# EAGLE design Datalogger (EAGLE 7.1.0)
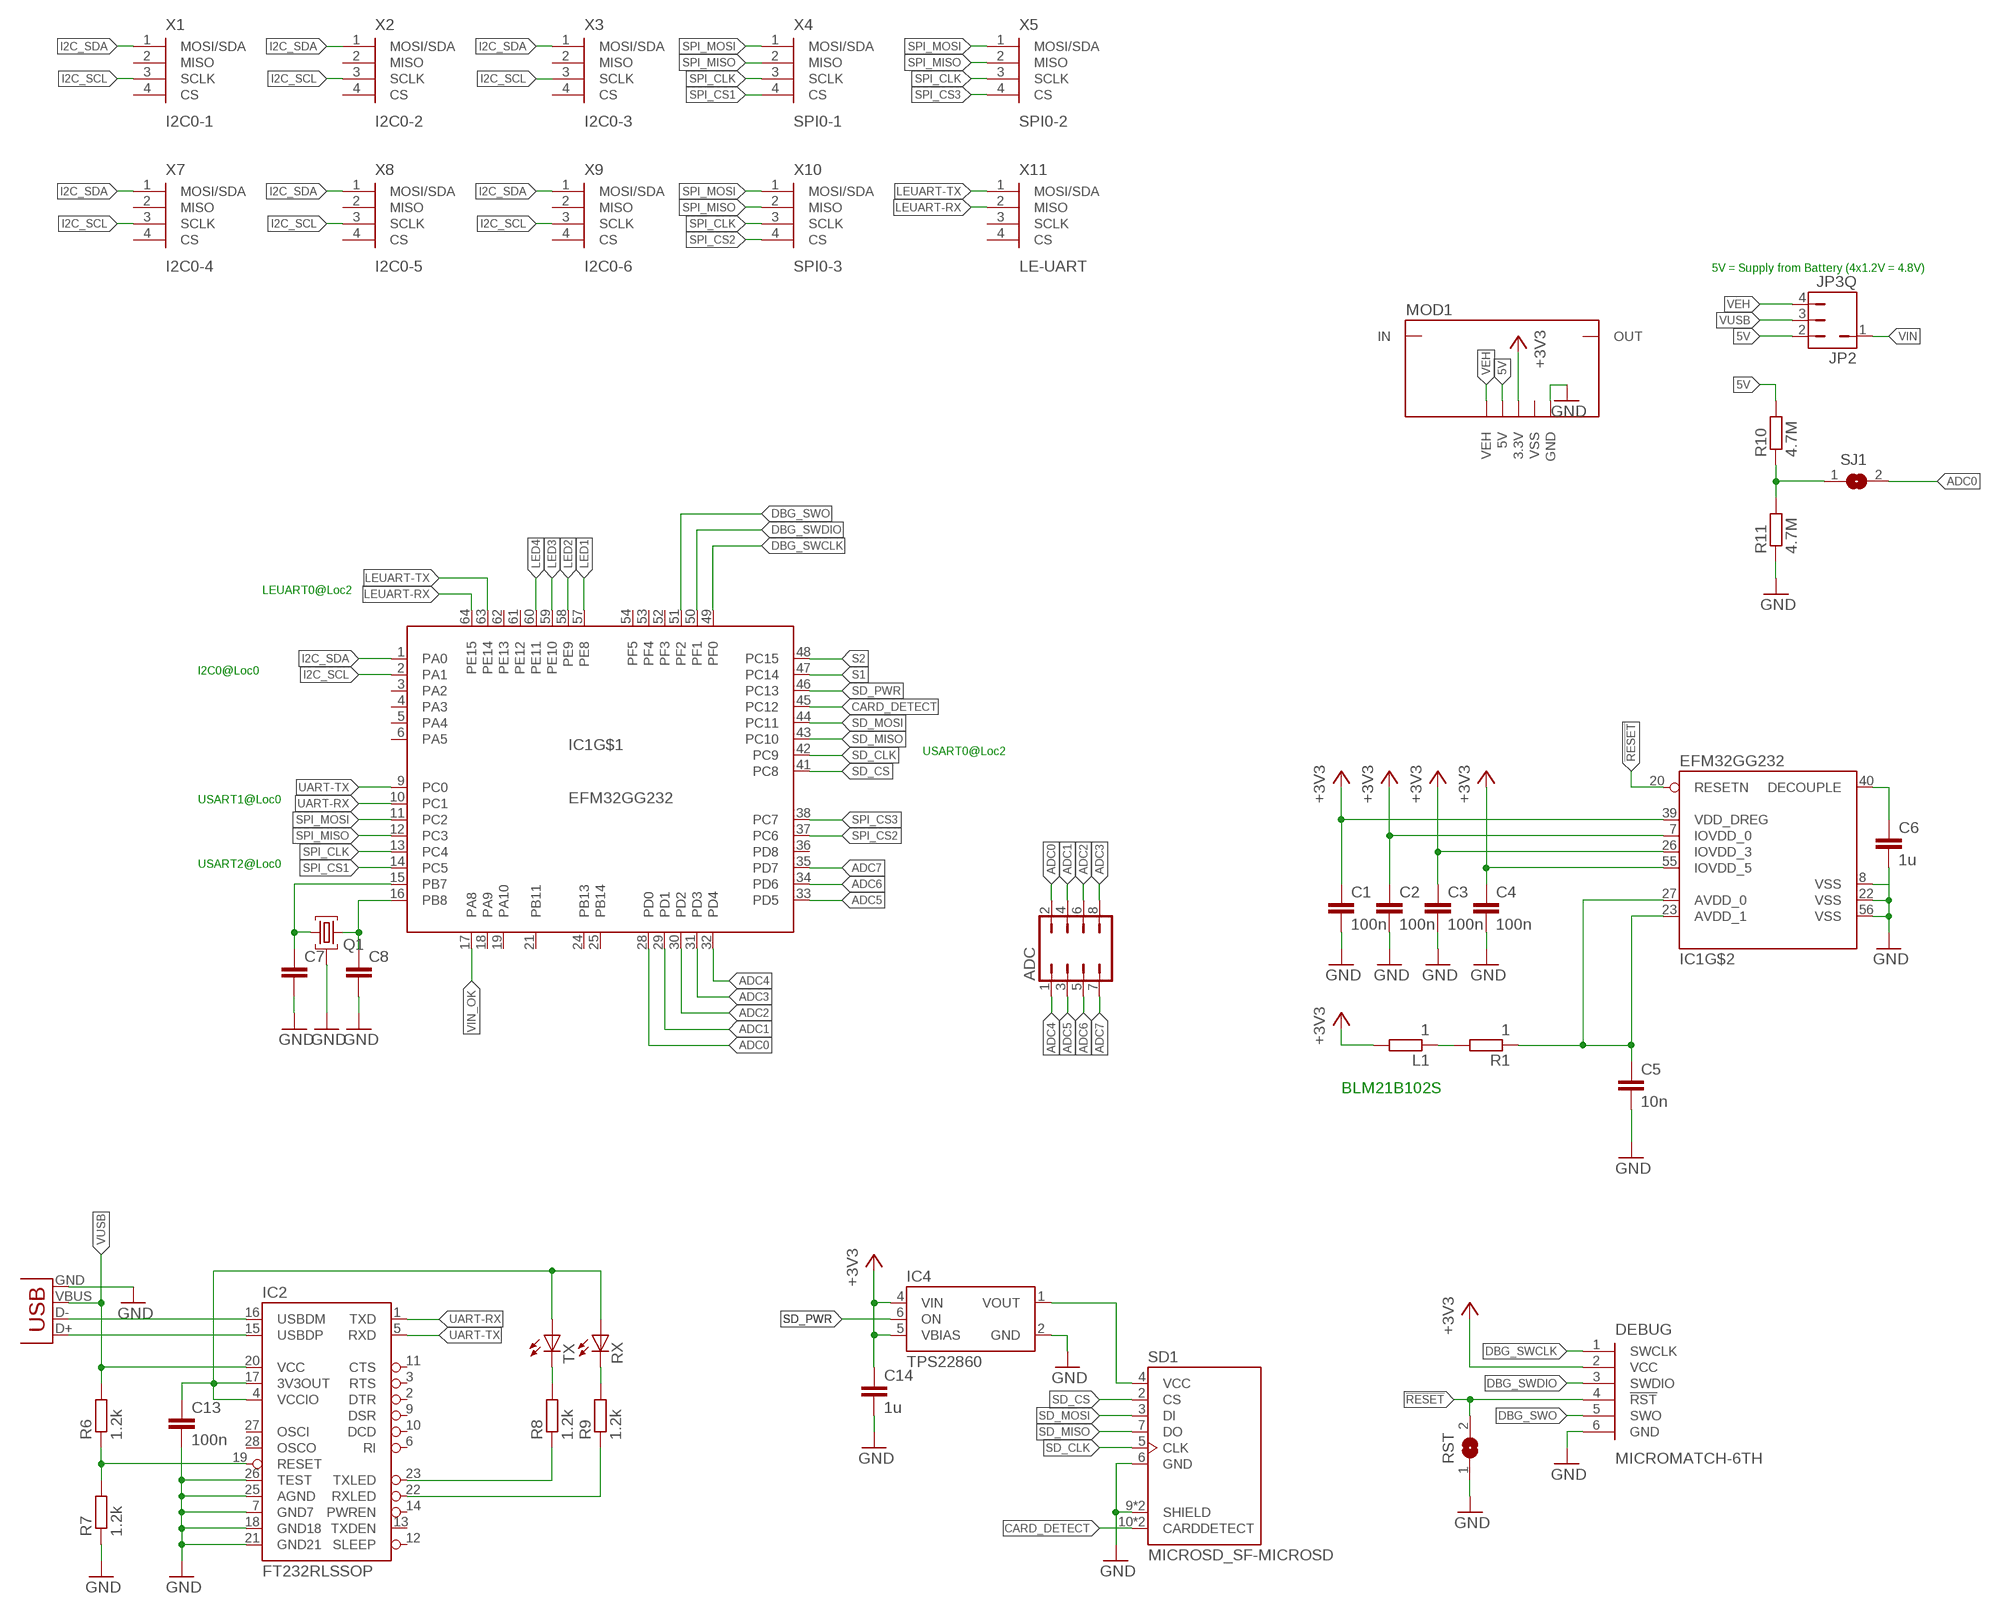
[diagram p0: schematic, sheet 1, part 1 of 2]
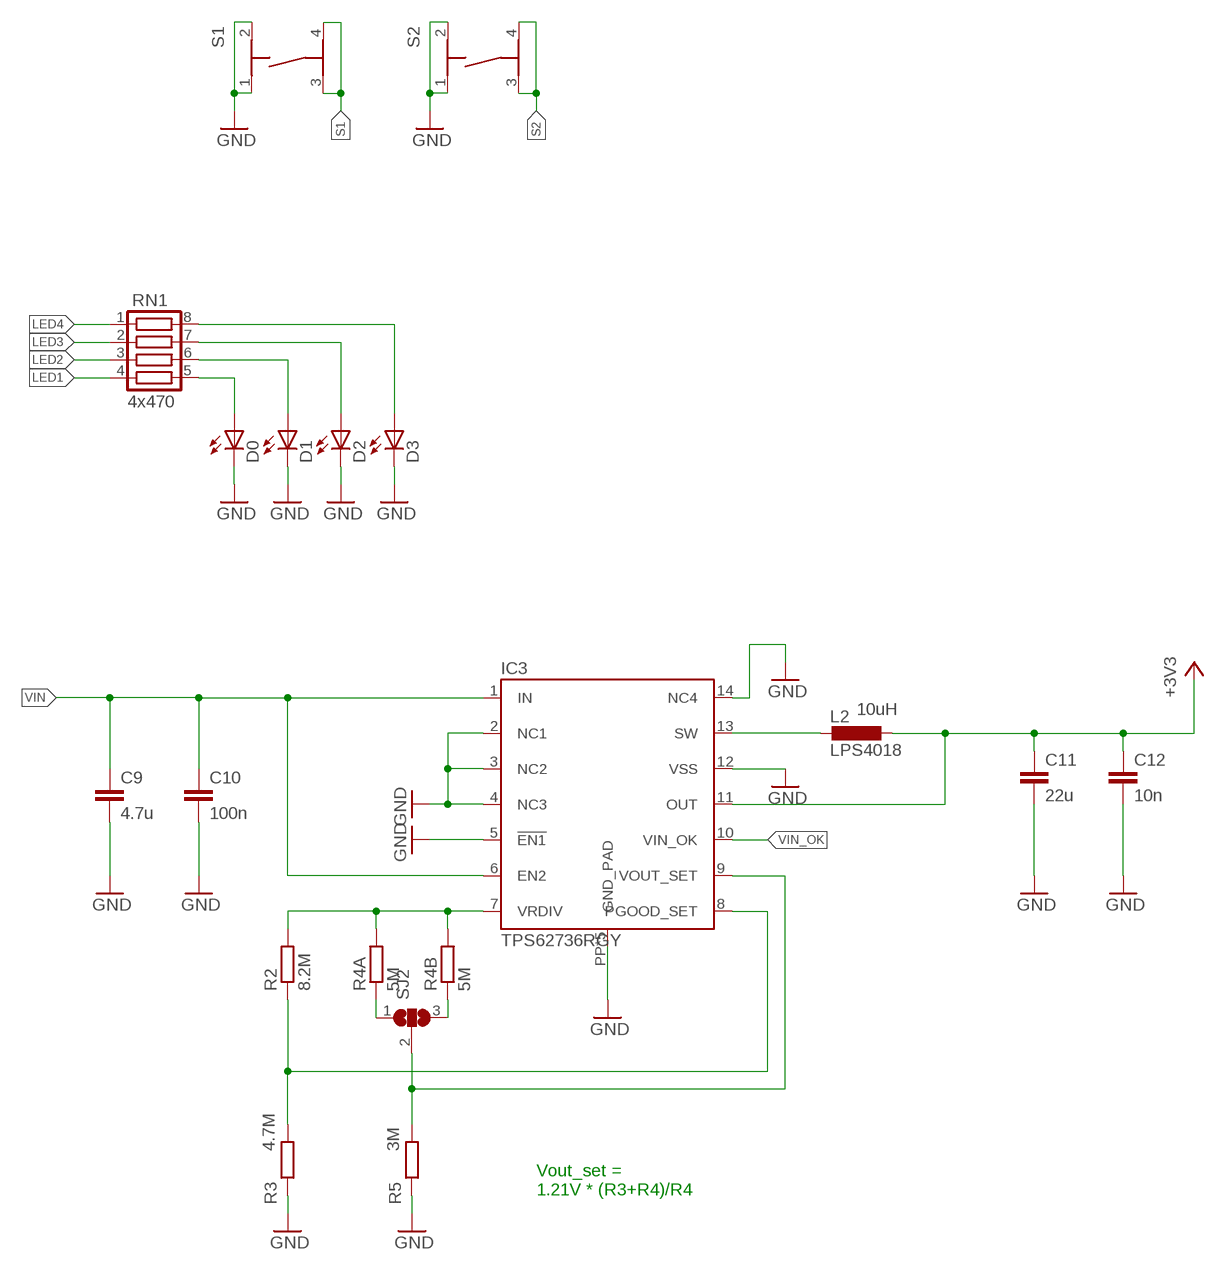
[diagram p1: schematic, sheet 1, part 2 of 2]

## Parts
ADC  JP2X4  [JP4X2]
C1  100n  C-EUC0603K  [C0603K]
C2  100n  C-EUC0603K  [C0603K]
C3  100n  C-EUC0603K  [C0603K]
C4  100n  C-EUC0603K  [C0603K]
C5  10n  C-EUC0603K  [C0603K]
C6  1u  C-EUC0805K  [C0805K]
C7  C-EUC0603K  [C0603K]
C8  C-EUC0603K  [C0603K]
C9  4.7u  C-EUC0805  [C0805]
C10  100n  C-EUC0805  [C0805]
C11  22u  C-EUC0805  [C0805]
C12  10n  C-EUC0805  [C0805]
C13  100n  C-EUC0805K  [C0805K]
C14  1u  C-EUC0805K  [C0805K]
D0  LEDCHIPLED_0805  [CHIPLED_0805]
D1  LEDCHIPLED_0805  [CHIPLED_0805]
D2  LEDCHIPLED_0805  [CHIPLED_0805]
D3  LEDCHIPLED_0805  [CHIPLED_0805]
DEBUG  MICROMATCH-6TH  [MICROMATCH-6]
IC1  EFM32GG232  [QFP64]
IC2  FT232RLSSOP  [SSOP28DB]
IC3  TPS62736RGY  [S-PVQFN-N14]
IC4  TPS22860  [SOT23-6]
JP2  JP3Q  [JP1-3]
L1  1  R-EU_R0805  [R0805]
L2  LPS4018  [LPS4018]
MOD1  2M-SISO_INT  [2M-SISO-NNNN-SUP]
Q1  TC38H  [TC38H]
R1  1  R-EU_R0805  [R0805]
R2  8.2M  R-EU_R0805  [R0805]
R3  4.7M  R-EU_R0805  [R0805]
R4A  5M  R-EU_R0805  [R0805]
R4B  5M  R-EU_R0805  [R0805]
R5  3M  R-EU_R0805  [R0805]
R6  1.2k  R-EU_R0805  [R0805]
R7  1.2k  R-EU_R0805  [R0805]
R8  1.2k  R-EU_R0805  [R0805]
R9  1.2k  R-EU_R0805  [R0805]
R10  4.7M  R-EU_R0805  [R0805]
R11  4.7M  R-EU_R0805  [R0805]
RN1  4x470  CTS742C083  [CTS742C083]
RST  SJ2  [SJ2]
RX  LEDCHIPLED_0805  [CHIPLED_0805]
S1  TASTER-9314_SMD  [TASTER-9314_SMD]
S2  TASTER-9314_SMD  [TASTER-9314_SMD]
SD1  MICROSD_SF-MICROSD  [MICROSD_MICROSD]
SJ1  SJ2  [SJ2]
SJ2  SJ3  [SJ3]
TX  LEDCHIPLED_0805  [CHIPLED_0805]
X1  I2C0-1  MICROMATCH-4SMD  [MICROMATCH-4SMD]
X2  I2C0-2  MICROMATCH-4SMD  [MICROMATCH-4SMD]
X3  I2C0-3  MICROMATCH-4SMD  [MICROMATCH-4SMD]
X4  SPI0-1  MICROMATCH-4SMD  [MICROMATCH-4SMD]
X5  SPI0-2  MICROMATCH-4SMD  [MICROMATCH-4SMD]
X7  I2C0-4  MICROMATCH-4SMD  [MICROMATCH-4SMD]
X8  I2C0-5  MICROMATCH-4SMD  [MICROMATCH-4SMD]
X9  I2C0-6  MICROMATCH-4SMD  [MICROMATCH-4SMD]
X10  SPI0-3  MICROMATCH-4SMD  [MICROMATCH-4SMD]
X11  LE-UART  MICROMATCH-4SMD  [MICROMATCH-4SMD]
XUSB  USB-SMD-NS  [USB-MINIB-NOSTOP]

## Nets
5V: JP2.2 MOD1.5V R10.2
!RESET: DEBUG.4(!RST) IC1.20(RESETN) RST.2
+3V3: C1.1 C2.1 C3.1 C4.1 C11.1 C12.1 C14.1 DEBUG.2(VCC) IC1.7(IOVDD_0) IC1.26(IOVDD_3) IC1.39(VDD_DREG) IC1.55(IOVDD_5) IC3.11(OUT) IC4.4(VIN) IC4.5(VBIAS) L1.2 L2.2 MOD1.3.3V
ADC0: ADC.2 IC1.28(PD0) SJ1.2
ADC1: ADC.4 IC1.29(PD1)
ADC2: ADC.6 IC1.30(PD2)
ADC3: ADC.8 IC1.31(PD3)
ADC4: ADC.1 IC1.32(PD4)
ADC5: ADC.3 IC1.33(PD5)
ADC6: ADC.5 IC1.34(PD6)
ADC7: ADC.7 IC1.35(PD7)
CARD_DETECT: IC1.45(PC12) SD1.10(CARDDETECT) SD1.10.2(CARDDETECT)
DBG_SWCLK: DEBUG.1(SWCLK) IC1.49(PF0)
DBG_SWDIO: DEBUG.3(SWDIO) IC1.50(PF1)
DBG_SWO: DEBUG.5(SWO) IC1.51(PF2)
GND: C1.2 C2.2 C3.2 C4.2 C5.2 C6.2 C7.2 C8.2 C9.2 C10.2 C11.2 C12.2 C13.2 C14.2 D0.C D1.C D2.C D3.C DEBUG.6(GND) IC1.8(VSS) IC1.22(VSS) IC1.56(VSS) IC2.7(GND7) IC2.18(GND18) IC2.21(GND21) IC2.25(AGND) IC2.26(TEST) IC3.2(NC1) IC3.3(NC2) IC3.4(NC3) IC3.5(!EN1) IC3.12(VSS) IC3.14(NC4) IC3.PP(GND_PAD) IC3.PP@1(GND_PAD) IC3.PP@2(GND_PAD) IC3.PP@3(GND_PAD) IC3.PP@4(GND_PAD) IC4.2(GND) MOD1.GND1(GND) MOD1.GND2(GND) MOD1.GND3(GND) MOD1.GND4(GND) Q1.3 R3.1 R5.1 R7.1 R11.1 RST.1 S1.1 S1.2 S2.1 S2.2 SD1.6(GND) SD1.9(SHIELD) SD1.9.2(SHIELD) XUSB.GND
I2C_SCL: IC1.2(PA1) X1.3(SCLK) X2.3(SCLK) X3.3(SCLK) X7.3(SCLK) X8.3(SCLK) X9.3(SCLK)
I2C_SDA: IC1.1(PA0) X1.1(MOSI/SDA) X2.1(MOSI/SDA) X3.1(MOSI/SDA) X7.1(MOSI/SDA) X8.1(MOSI/SDA) X9.1(MOSI/SDA)
LED1: IC1.57(PE8) RN1.4
LED2: IC1.58(PE9) RN1.3
LED3: IC1.59(PE10) RN1.2
LED4: IC1.60(PE11) RN1.1
LEUART-RX: IC1.64(PE15) X11.2(MISO)
LEUART-TX: IC1.63(PE14) X11.1(MOSI/SDA)
N$1: IC2.16(USBDM) XUSB.D-
N$2: IC2.15(USBDP) XUSB.D+
N$3: L1.1 R1.2
N$4: R8.2 TX.C
N$5: IC2.19(RESET) R6.1 R7.2
N$6: C6.1 IC1.40(DECOUPLE)
N$7: R9.2 RX.C
N$8: C7.1 IC1.15(PB7) Q1.1
N$9: IC2.23(TXLED) R8.1
N$10: IC2.22(RXLED) R9.1
N$11: R4A.1 SJ2.1
N$12: C5.1 IC1.23(AVDD_1) IC1.27(AVDD_0) R1.1
N$13: C8.1 IC1.16(PB8) Q1.2
N$14: IC4.1(VOUT) SD1.4(VCC)
N$15: C13.1 IC2.4(VCCIO) IC2.17(3V3OUT) RX.A TX.A
N$16: R4B.1 SJ2.3
N$17: IC3.13(SW) L2.1
N$18: IC3.7(VRDIV) R2.2 R4A.2 R4B.2
N$23: D0.A RN1.5
N$24: D1.A RN1.6
N$25: D2.A RN1.7
N$26: D3.A RN1.8
N$140: R10.1 R11.2 SJ1.1
PGOOD_SET: IC3.8(PGOOD_SET) R2.1 R3.2
S1: IC1.47(PC14) S1.3 S1.4
S2: IC1.48(PC15) S2.3 S2.4
SD_CLK: IC1.42(PC9) SD1.5(CLK)
SD_CS: IC1.41(PC8) SD1.2(CS)
SD_MISO: IC1.43(PC10) SD1.7(DO)
SD_MOSI: IC1.44(PC11) SD1.3(DI)
SD_PWR: IC1.46(PC13) IC4.6(ON)
SPI_CLK: IC1.13(PC4) X4.3(SCLK) X5.3(SCLK) X10.3(SCLK)
SPI_CS1: IC1.14(PC5) X4.4(CS)
SPI_CS2: IC1.37(PC6) X10.4(CS)
SPI_CS3: IC1.38(PC7) X5.4(CS)
SPI_MISO: IC1.12(PC3) X4.2(MISO) X5.2(MISO) X10.2(MISO)
SPI_MOSI: IC1.11(PC2) X4.1(MOSI/SDA) X5.1(MOSI/SDA) X10.1(MOSI/SDA)
UART-RX: IC1.10(PC1) IC2.1(TXD)
UART-TX: IC1.9(PC0) IC2.5(RXD)
VEH: JP2.4 MOD1.VEH
VIN: C9.1 C10.1 IC3.1(IN) IC3.6(EN2) JP2.1
VIN_OK: IC1.17(PA8) IC3.10(VIN_OK)
VOUT_SET: IC3.9(VOUT_SET) R5.2 SJ2.2
VUSB: IC2.20(VCC) JP2.3 R6.2 XUSB.VBUS
Unconnected: IC1.3(PA2) IC1.4(PA3) IC1.5(PA4) IC1.6(PA5) IC1.18(PA9) IC1.19(PA10) IC1.21(PB11) IC1.24(PB13) IC1.25(PB14) IC1.36(PD8) IC1.52(PF3) IC1.53(PF4) IC1.54(PF5) IC1.61(PE12) IC1.62(PE13) IC2.2(DTR) IC2.3(RTS) IC2.6(RI) IC2.9(DSR) IC2.10(DCD) IC2.11(CTS) IC2.12(SLEEP) IC2.13(TXDEN) IC2.14(PWREN) IC2.27(OSCI) IC2.28(OSCO) MOD1.IN1(IN) MOD1.IN2(IN) MOD1.IN3(IN) MOD1.IN4(IN) MOD1.OUT2_1(OUT) MOD1.OUT2_2(OUT) MOD1.OUT2_3(OUT) MOD1.OUT2_4(OUT) X1.2(MISO) X1.4(CS) X2.2(MISO) X2.4(CS) X3.2(MISO) X3.4(CS) X7.2(MISO) X7.4(CS) X8.2(MISO) X8.4(CS) X9.2(MISO) X9.4(CS) X11.3(SCLK) X11.4(CS)

## Notes on the sheet
- 5V = Supply from Battery (4x1.2V = 4.8V)
- LEUART0@Loc2
- 10uH
- I2C0@Loc0
- USART0@Loc2
- USART1@Loc0
- USART2@Loc0
- Vout_set =
  1.21V * (R3+R4)/R4
- BLM21B102S

## Power pins joined to a net without a drawn wire
VSS: MOD1.VSS

## Library data of the parts
ADC = Jumper_mod:JP2X4: JUMPER
C1-C14 = rcl:C-EU: CAPACITOR, European symbol
D0 D1-D3 RX TX = led:LED: LED OSRAM: - CHIPLED LG R971, LG N971, LY N971, LG Q971, LY Q971, LO R971, LY R971 LH N974, LH R974 LS Q976, LO Q976, LY Q976 LO Q996 - Hyper CHIPLED LW Q18S LB Q993, LB Q99A, LB R99A - SideLED LS A670, LO A670, LY A670, LG A670, LP A670 LB A673, LV A673, LT A673, LW A673 LH A674 LY A675 LS A676, LA A676, LO A676, LY A676, LW A676 LS A679, LY A679, LG A679 - Hyper Micro SIDELED® LS Y876, LA Y876, LO Y876, LY Y876 LT Y87S - SmartLED LW L88C, LW L88S LB L89C, LB L89S, LG L890 LS L89K, LO L89K, LY L89K LS L896, LA L896, LO L896, LY L896 - TOPLED LS T670, LO T670, LY T670, LG T670, LP T670 LSG T670, LSP T670, LSY T670, LOP T670, LYG T670 LG T671, LOG T671, LSG T671 LB T673, LV T673, LT T673, LW T673 LH T674 LS T676, LA T676, LO T676, LY T676, LB T676, LH T676, LSB T676, LW T676 LB T67C, LV T67C, LT T67C, LS T67K, LO T67K, LY T67K, LW E67C LS E67B, LA E67B, LO E67B, LY E67B, LB E67C, LV E67C, LT E67C LW T67C LS T679, LY T679, LG T679 LS T770, LO T770, LY T770, LG T770, LP T770 LB T773, LV T773, LT T773, LW T773 LH T774 LS E675, LA E675, LY E675, LS T675 LS T776, LA T776, LO T776, LY T776, LB T776 LHGB T686 LT T68C, LB T68C - Hyper Mini TOPLED® LB M676 - Mini TOPLED Santana® LG M470 LS M47K, LO M47K, LY M47K Source: http://www.osram.convergy.de LUXEON: - LUMILED® LXK2-PW12-R00, LXK2-PW12-S00, LXK2-PW14-U00, LXK2-PW14-V00 LXK2-PM12-R00, LXK2-PM12-S00, LXK2-PM14-U00 LXK2-PE12-Q00, LXK2-PE12-R00, LXK2-PE12-S00, LXK2-PE14-T00, LXK2-PE14-U00 LXK2-PB12-K00, LXK2-PB12-L00, LXK2-PB12-M00, LXK2-PB14-N00, LXK2-PB14-P00, LXK2-PB14-Q00 LXK2-PR12-L00, LXK2-PR12-M00, LXK2-PR14-Q00, LXK2-PR14-R00 LXK2-PD12-Q00, LXK2-PD12-R00, LXK2-PD12-S00 LXK2-PH12-R00, LXK2-PH12-S00 LXK2-PL12-P00, LXK2-PL12-Q00, LXK2-PL12-R00 Source: www.luxeon.com KINGBRIGHT: KA-3528ASYC Source: www.kingbright.com
DEBUG = con-amp-micromatch_mod:MICROMATCH-6: MicroMaTch 6 7-215464-6 / 0-215464-6 Drawing Number C-215464 DDEController.pdf
IC1 = EFM32GG232:EFM32GG232
IC2 = FT232RL:FT232RL: USB UART FT232RL 4th Generation USB UART (USB <-> Serial) Controller. Spark Fun Electronics SKU : COM-00650
IC3 = TPS62736:TPS62736RGY
IC4 = TPS22860:TPS22860
JP2 = Jumper_mod:JP3Q
L1 R1-R3 R4A R4B R5-R11 = rcl:R-EU_: RESISTOR, European symbol
L2 = LPS4018:LPS4018: COILCRAFT
MOD1 = AllModules:2M-SISO_INT
Q1 = 32kHz-Crystal:TC38H: CRYSTAL
RN1 = resistor-net:CTS742C083: Chip Resistor Array 4 Single Resistor Source: http://www.ctscorp.com/components/Datasheets/CTSChipArrayDs.pdf; OC_FARNELL: unknown; OC_NEWARK: unknown
RST SJ1 = Jumper_mod:SJ2: SMD solder JUMPER
S1 S2 = PushButton:TASTER-9314_SMD
SD1 = sd-card:MICROSD_SF-MICROSD
SJ2 = Jumper_mod:SJ3: SMD solder JUMPER
X1-X5 X7-X11 = con-amp-micromatch_mod:MICROMATCH-4: MicroMaTch 4 7-215464-4 / 0-215464-4 Drawing Number C-215464 DDEController.pdf
XUSB = con-USB:USB: USB Connectors USB-B-PTH is fully proven SKU : PRT-00139 USB-miniB is fully proven SKU : PRT-00587 USB-A-PCB is untested. USB-A-H is throughly reviewed, but untested. Spark Fun Electronics SKU : PRT-00437 USB-B-SMT is throughly reviewed, but untested. Needs silkscreen touching up. USB-A-S has not been used/tested USB-MB-H has not been used/tested

## Board
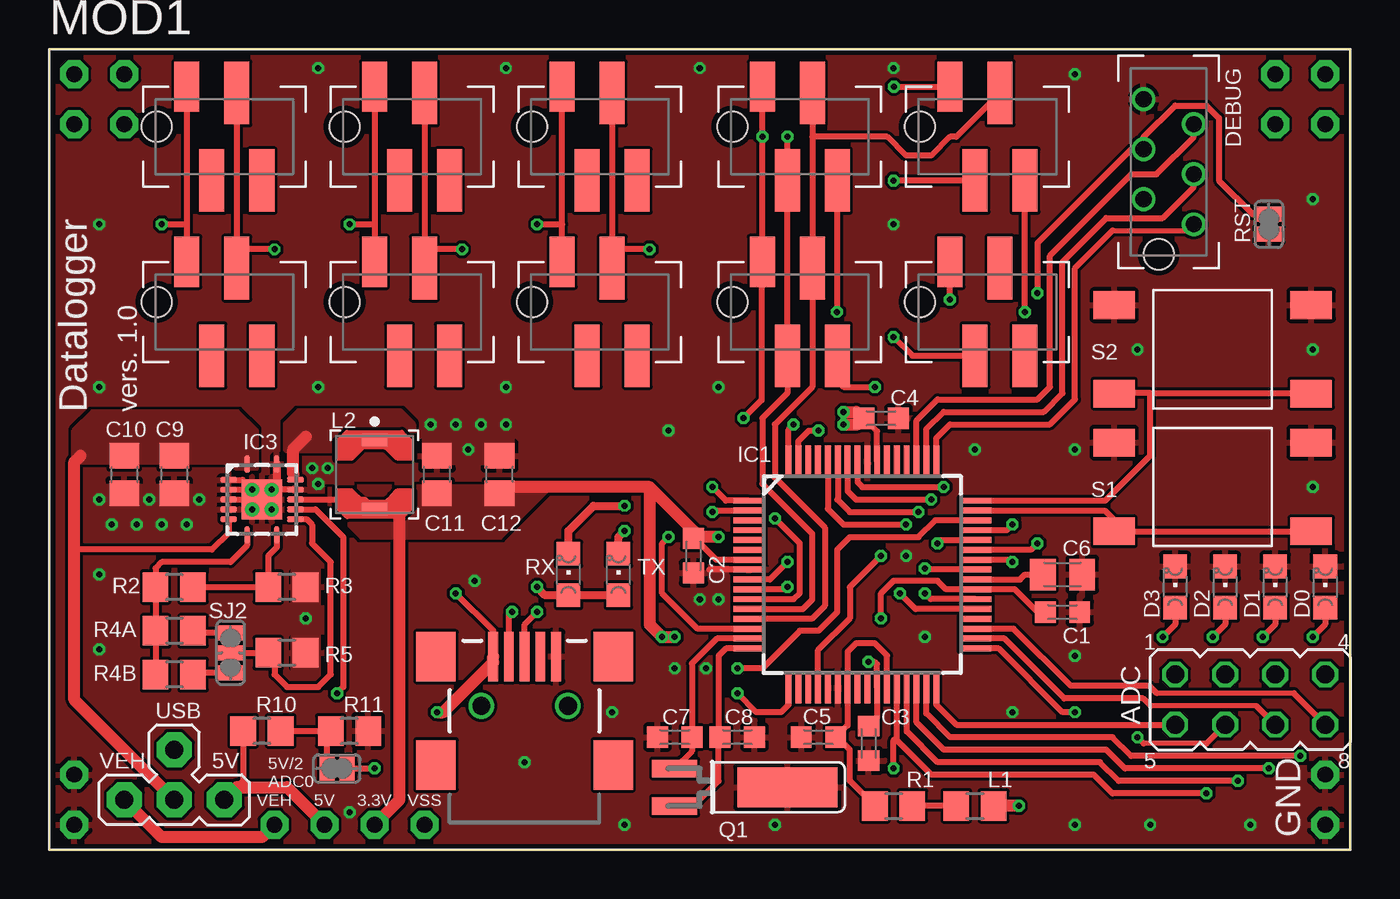
[diagram p2: board, top side]
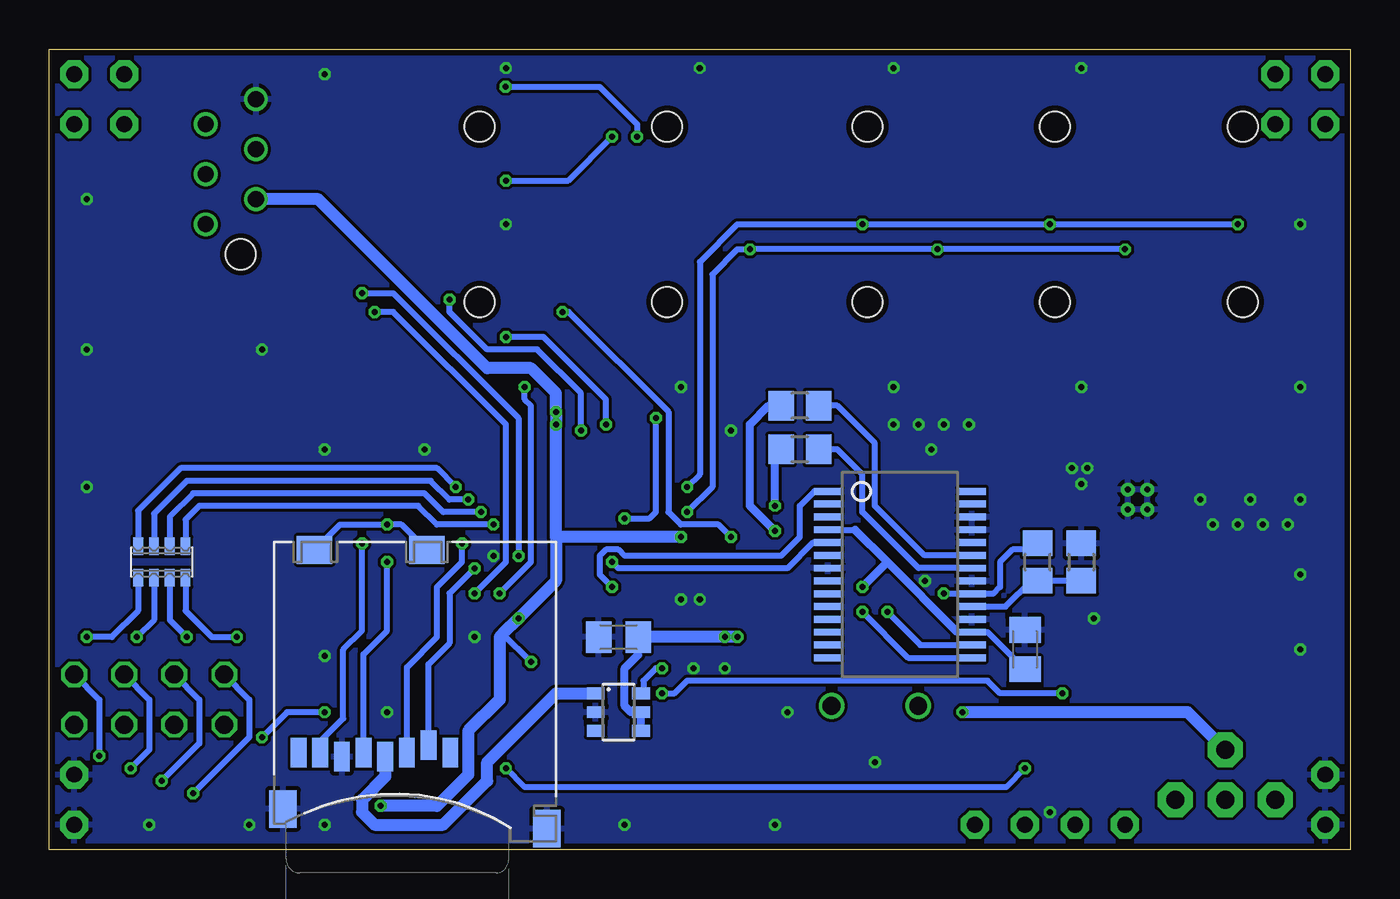
[diagram p3: board, bottom side, seen from below]

Size 66.04 x 40.64 mm. Coordinates in mm from the lower left corner, seen from the top.
Outline: 0,0 66.04,0 66.04,40.64 0,40.64 0,0
Copper layers (1*16): Top 0.035mm / dielectric 1.5mm / Bottom 0.035mm
Design rules "PCB-POOL Standard *": minimum track width 0.15mm, minimum drill 0.3mm, track to track 0.15mm, track to pad 0.15mm, pad to pad 0.15mm, via to via 0.15mm, smd to smd 0.15mm, copper to edge 0.3mm, drill to drill 0.2mm, minimum pad ring 0.2mm, minimum via ring 0.15mm, stop-mask expansion 0.075mm, vias tented up to drill 0mil, thermal gap 0.2mm

### Footprints (pad centres in the part's own frame; a part is rotated, then mirrored left to right if it is on the bottom)
JP4X2 = drill 0.914 octagon: 1 -3.81,-1.27; 2 -3.81,1.27; 3 -1.27,-1.27; 4 -1.27,1.27; 5 1.27,-1.27; 6 1.27,1.27; 7 3.81,-1.27; 8 3.81,1.27
C0603K = smd 1.05 x 1.08: 1 -0.875,0; 2 0.875,0
C0805K = smd 1.3 x 1.6: 1 -1,0; 2 1,0
C0805 = smd 1.3 x 1.5: 1 -0.95,0; 2 0.95,0
CHIPLED_0805 = smd 1.2 x 1.2: A 0,-1.05; C 0,1.05
MICROMATCH-6 = drill 0.813: 1 3.175,1.27; 2 1.905,-1.27; 3 0.635,1.27; 4 -0.635,-1.27; 5 -1.905,1.27; 6 -3.175,-1.27 | hole 1.524: 4.699,-0.508
QFP64 = smd 1.6 x 0.3: 1 -5.75,3.75; 2 -5.75,3.25; 3 -5.75,2.75; 4 -5.75,2.25; 5 -5.75,1.75; 6 -5.75,1.25; 7 -5.75,0.75; 8 -5.75,0.25; 9 -5.75,-0.25; 10 -5.75,-0.75; 11 -5.75,-1.25; 12 -5.75,-1.75; 13 -5.75,-2.25; 14 -5.75,-2.75; 15 -5.75,-3.25; 16 -5.75,-3.75; 33 5.75,-3.75; 34 5.75,-3.25; 35 5.75,-2.75; 36 5.75,-2.25; 37 5.75,-1.75; 38 5.75,-1.25; 39 5.75,-0.75; 40 5.75,-0.25; 41 5.75,0.25; 42 5.75,0.75; 43 5.75,1.25; 44 5.75,1.75; 45 5.75,2.25; 46 5.75,2.75; 47 5.75,3.25; 48 5.75,3.75 | smd 0.3 x 1.6: 17 -3.75,-5.75; 18 -3.25,-5.75; 19 -2.75,-5.75; 20 -2.25,-5.75; 21 -1.75,-5.75; 22 -1.25,-5.75; 23 -0.75,-5.75; 24 -0.25,-5.75; 25 0.25,-5.75; 26 0.75,-5.75; 27 1.25,-5.75; 28 1.75,-5.75; 29 2.25,-5.75; 30 2.75,-5.75; 31 3.25,-5.75; 32 3.75,-5.75; 49 3.75,5.75; 50 3.25,5.75; 51 2.75,5.75; 52 2.25,5.75; 53 1.75,5.75; 54 1.25,5.75; 55 0.75,5.75; 56 0.25,5.75; 57 -0.25,5.75; 58 -0.75,5.75; 59 -1.25,5.75; 60 -1.75,5.75; 61 -2.25,5.75; 62 -2.75,5.75; 63 -3.25,5.75; 64 -3.75,5.75
SSOP28DB = smd 0.348 x 1.397: 1 -4.225,-3.656; 2 -3.575,-3.656; 3 -2.925,-3.656; 4 -2.275,-3.656; 5 -1.625,-3.656; 6 -0.975,-3.656; 7 -0.325,-3.656; 8 0.325,-3.656; 9 0.975,-3.656; 10 1.625,-3.656; 11 2.275,-3.656; 12 2.925,-3.656; 13 3.575,-3.656; 14 4.225,-3.656; 15 4.225,3.656; 16 3.575,3.656; 17 2.925,3.656; 18 2.275,3.656; 19 1.625,3.656; 20 0.975,3.656; 21 0.325,3.656; 22 -0.325,3.656; 23 -0.975,3.656; 24 -1.625,3.656; 25 -2.275,3.656; 26 -2.925,3.656; 27 -3.575,3.656; 28 -4.225,3.656
S-PVQFN-N14 = smd 0.85 x 0.28: 1 -1.8,-0.75; 7 1.8,-0.75; 8 1.8,0.75; 14 -1.8,0.75 | smd 0.28 x 0.85: 2 -1,-1.688; 3 -0.5,-1.688; 4 0,-1.688; 5 0.5,-1.688; 6 1,-1.688; 9 1,1.7; 10 0.5,1.7; 11 0,1.7; 12 -0.5,1.7; 13 -1,1.7 | smd 2.05 x 2.05: PP 0,0 | drill 0.3 pad 0.4: PP@1 -0.5,0.5; PP@2 0.5,0.5; PP@3 -0.5,-0.5; PP@4 0.5,-0.5
SOT23-6 = smd 0.9 x 0.6: 1 -1.15,0.95; 2 -1.15,0; 3 -1.15,-0.95; 4 1.15,-0.95; 5 1.15,0; 6 1.15,0.95
JP1-3 = drill 0.914 pad 1.778 octagon: 1 0,0; 2 0,2.54; 3 -2.54,0; 4 0,-2.54
R0805 = smd 1.3 x 1.5: 1 -0.95,0; 2 0.95,0
LPS4018 = smd 0.635 x 1.27: 1 -1.765,0; 2 1.765,0
2M-SISO-NNNN-SUP = drill 0.8 pad 1.422 octagon: 3.3V 15.24,-38.1; 5V 12.7,-38.1; GND1 0,-38.1; GND2 0,-35.56; GND3 63.5,-35.56; GND4 63.5,-38.1; IN1 0,0; IN2 0,-2.54; IN3 2.54,0; IN4 2.54,-2.54; OUT2_1 60.96,0; OUT2_2 60.96,-2.54; OUT2_3 63.5,0; OUT2_4 63.5,-2.54; VEH 10.16,-38.1; VSS 17.78,-38.1
TC38H = smd 0.889 x 2.286: 1 -0.953,-3.175; 2 0.953,-3.175 | smd 2.032 x 5.08: 3 0,2.54
CTS742C083 = smd 0.5 x 0.9: 1 -1.2,-0.8; 2 -0.4,-0.8; 3 0.4,-0.8; 4 1.2,-0.8; 5 1.2,0.8; 6 0.4,0.8; 7 -0.4,0.8; 8 -1.2,0.8
SJ2 = smd 0.762 x 1.27: 1 -0.508,0; 2 0.508,0
TASTER-9314_SMD = smd 2.1 x 1.4: 1 -5,2.25; 2 5,2.25; 3 -5,-2.25; 4 5,-2.25
MICROSD_MICROSD = smd 0.8 x 1.5: 1 -1.94,2.7; 2 -0.84,2.3; 3 0.26,2.7; 4 1.36,2.9; 5 2.46,2.7; 6 3.56,2.9; 7 4.66,2.7; 8 5.76,2.7 | smd 1.4 x 1.9: 9 -6.85,6.55; 9.2 6.55,5.55 | smd 1.8 x 1.4: 10 -0.75,-7.6; 10.2 4.95,-7.6
SJ3 = smd 0.762 x 1.27: 1 -1.016,0; 2 0,0; 3 1.016,0
MICROMATCH-4SMD = smd 1.27 x 2.54: 1 1.905,-2.54 | smd 1.27 x 3.175: 2 0.635,2.223; 3 -0.635,-2.223; 4 -1.905,2.223 | hole 1.524: 3.429,-0.508
USB-MINIB-NOSTOP = smd 2.5 x 0.5: D+ 2.5,0; D- 2.5,0.8; GND 2.5,-1.6; ID 2.5,-0.8; VBUS 2.5,1.6 | smd 2.5 x 2: G1 -3,-4.5; G2 -3,4.5; G3 2.5,4.5; G4 2.5,-4.5 | drill 0.9 pad 0.8: H1 0,2.2 | drill 0.9 pad 0.787: H2 0,-2.2

### Placement (x,y rotation side)
ADC  60.96,7.62 0 top
C1  51.44,12.06 0 top
C2  32.7,14.92 270 top
C3  41.59,5.4 270 top
C4  42.23,21.91 0 top
C5  39.05,5.71 180 top
C6  51.44,13.97 0 top
C7  31.75,5.71 180 top
C8  34.92,5.71 0 top
C9  6.35,19.05 270 top
C10  3.81,19.05 270 top
C11  19.68,19.05 90 top
C12  22.86,19.05 90 top
C13  16.51,10.16 90 bottom
C14  37.15,10.79 180 bottom
D0  64.77,13.34 0 top
D1  62.23,13.34 0 top
D2  59.69,13.34 0 top
D3  57.15,13.34 0 top
DEBUG  56.82,34.92 270 top
IC1  41.27,13.97 0 top
IC2  22.86,13.97 270 bottom
IC3  10.79,17.78 270 top
IC4  37.15,6.99 0 bottom
JP2  6.35,2.54 270 top
L1  46.99,2.22 0 top
L2  16.51,19.05 270 top
MOD1  1.27,39.37 0 top
Q1  34.92,3.17 270 top
R1  42.86,2.22 0 top
R2  6.35,13.34 180 top
R3  12.06,13.34 180 top
R4A  6.35,11.11 180 top
R4B  6.35,8.89 180 top
R5  12.06,10 180 top
R6  15.88,14.61 90 bottom
R7  13.65,14.61 270 bottom
R8  27.94,22.54 180 bottom
R9  27.94,20.32 180 bottom
R10  10.79,6.03 180 top
R11  15.24,6.03 180 top
RN1  60.33,14.61 180 bottom
RST  61.91,31.75 90 top
RX  26.35,13.97 0 top
S1  59.05,18.41 0 top
S2  59.05,25.4 0 top
SD1  47.62,7.62 180 bottom
SJ1  14.61,4.13 0 top
SJ2  9.21,10 270 top
TX  28.89,13.97 0 top
X1  8.89,36.2 180 top
X2  18.41,36.2 180 top
X3  27.94,36.2 180 top
X4  38.1,36.2 180 top
X5  47.62,36.2 180 top
X7  8.89,27.3 180 top
X8  18.41,27.3 180 top
X9  27.94,27.3 180 top
X10  38.1,27.3 180 top
X11  47.62,27.3 180 top
XUSB  24.13,7.3 90 top

### Tracks (layer width: path | path; a pad name or v marks a point on that pad's centre or on a via)
5V
  Top 0.305: 9.21,2.86 JP2.2 | R10.2 9.85,3.5 9.53,3.17
  Top 0.61: JP2.2 9.53,3.17 12.06,3.17 MOD1.5V
!RESET  (via drill 0.3)
  Top 0.305: IC1.20 39.02,10.13 40.64,11.75 40.64,13.34 v42.23,14.92 | v50.16,28.26 50.16,30.8 54.93,35.56 DEBUG.4 55.55,36.18 57.15,37.78 58.74,37.78 59.37,37.15 59.37,33.97 61.09,32.26 RST.2
  Bottom 0.305: v50.16,28.26 48.58,28.26 42.23,21.91 v42.23,14.92
+3V3  (via drill 0.3)
  Top 0.305: IC3.11 16.02,17.78 L2.2 | IC1.7 33.86,14.72 32.78,15.8 C2.1 | C3.1 42.02,6.71 IC1.26 42.02,9.41 41.91,9.53 v41.59,9.53 | C1.1 50.16,12.06 49.01,13.22 IC1.39 45.52,13.22 45.09,13.65 42.86,13.65 42.23,13.02 v42.23,11.75 | IC1.55 42.02,21.23 C4.1
  Top 0.61: MOD1.3.3V 17.78,2.54 17.78,17.14 | 30.48,18.41 23.18,18.41 C12.1 | 30.48,18.41 30.48,11.43 v31.11,10.79 v31.75,10.79 | v40.32,21.59 41.03,21.59 C4.1 | v40.32,22.23 40.96,22.23 41.27,21.91 | v49.21,2.22 L1.2 | v33.97,15.88 32.78,15.88 | 32.78,15.88 C2.1 | 32.78,15.88 32.78,16.11 30.48,18.41
  Bottom 0.305: v41.59,9.53 43.02,10.95
  Bottom 0.406: IC4.4 IC4.5 36.51,6.99 36.83,7.3 36.83,9.21 36.15,9.89 C14.1
  Bottom 0.61: C14.1 v31.75,10.79 v31.11,10.79 | v33.97,15.88 40.32,15.88 | 40.32,15.88 v40.32,21.59 v40.32,22.23 40.32,23.18 41.59,24.45 43.81,24.45 52.39,33.02 DEBUG.2 | 40.32,15.88 40.32,13.65 v42.23,11.75 43.02,10.95 43.18,10.79 43.18,7.62 44.77,6.03 44.77,3.81 46.35,2.22 v49.21,2.22
  pour Top (no thermals): 15.88,15.88 14.29,17.46 14.29,18.41 25.4,18.41 22.86,15.88
ADC0  (via drill 0.3)
  Top 0.305: v58.74,2.86 53.98,2.86 53.02,3.81 44.77,3.81 43.02,5.55 43.02,5.71 | 43.02,5.71 IC1.28 | SJ1.2 v16.51,4.13 | v42.86,4.13 42.86,5.55 43.02,5.71
  Bottom 0.305: v58.74,2.86 55.88,5.71 55.88,7.62 ADC.2 | v16.51,4.13 17.46,3.17 41.91,3.17 v42.86,4.13
ADC1  (via drill 0.3)
  Top 0.305: v60.33,3.49 54.29,3.49 53.34,4.45 45.09,4.45 43.52,6 IC1.29
  Bottom 0.305: v60.33,3.49 58.42,5.4 58.42,7.62 ADC.4
ADC2  (via drill 0.3)
  Top 0.305: v61.91,4.13 54.61,4.13 53.66,5.08 45.4,5.08 44.02,6.46 IC1.30
  Bottom 0.305: v61.91,4.13 60.96,5.08 60.96,7.62 ADC.6
ADC3  (via drill 0.3)
  Top 0.305: v63.5,4.76 54.93,4.76 53.98,5.71 45.72,5.71 44.52,6.91 IC1.31
  Bottom 0.305: v63.5,4.76 63.5,7.62 ADC.8
ADC4
  Top 0.305: IC1.32 45.02,7.36 46.04,6.35 ADC.1
ADC5  (via drill 0.3)
  Top 0.254: 58.74,5.4 55.56,5.4
  Top 0.305: 55.56,5.4 v55.24,5.71 | v52.07,6.99 51.44,6.99 48.2,10.22 IC1.33 | ADC.3 58.74,5.4
  Bottom 0.305: v52.07,6.99 53.98,6.99 v55.24,5.71
ADC6
  Top 0.254: 61.28,7.3 55.91,7.3
  Top 0.305: 55.91,7.3 55.53,7.68 51.53,7.68 48.49,10.72 IC1.34 | ADC.5 61.28,7.3
ADC7
  Top 0.254: 63.18,7.94 56.22,7.94
  Top 0.305: 56.22,7.94 55.84,8.32 51.85,8.32 48.95,11.22 IC1.35 | ADC.7 63.18,7.94
CARD_DETECT  (via drill 0.3)
  Top 0.305: v48.9,16.51 48.6,16.22 IC1.45
  Bottom 0.305: SD1.10 48.16,16.51 v48.9,16.51 51.28,16.51 SD1.10.2
DBG_SWCLK
  Top 0.254: 53.98,31.43 57.77,31.43
  Top 0.305: IC1.49 45.02,20.89 45.72,21.59 50.8,21.59 52.07,22.86 52.07,29.53 53.98,31.43 | 57.77,31.43 DEBUG.1
DBG_SWDIO
  Top 0.305: IC1.50 44.52,21.35 45.4,22.23 50.48,22.23 51.44,23.18 51.44,29.84 53.66,32.07 56.52,32.07 58.09,33.64 DEBUG.3
DBG_SWO
  Top 0.305: IC1.51 44.02,21.8 45.09,22.86 50.16,22.86 50.8,23.5 50.8,30.16 54.93,34.29 56.2,34.29 58.09,36.18 DEBUG.5
GND  (via drill 0.3)
  Top 0.305: IC3.2 9.79,18.78 IC3.PP@3 | IC3.PP@3 IC3.PP@2 | IC3.4 10.29,17.78 IC3.PP@4 | IC3.3 IC3.PP@3 | IC3.12 IC3.PP@1 | IC1.8 33.51,14.22
  Top 0.406: IC3.14 11.54,18.53 IC3.PP@1 IC3.PP@4
  other vias: 19.37,21.59 20.64,21.59 21.91,21.59 23.18,21.59 5.71,16.51 6.99,16.51 4.45,16.51 3.17,16.51 13.65,18.57 13.34,19.37 14.13,19.37 5.08,17.78 2.54,17.78 7.62,17.78 21.27,20.32 13.02,11.75 33.97,12.7 33.02,12.7 15.24,1.91 42.86,39.69 42.86,31.75 33.02,39.69 23.18,39.69 13.65,39.69 23.18,23.5 13.65,23.5 33.97,23.5 46.99,20.32 52.07,20.32 52.07,9.84 48.9,6.99 44.45,10.79 52.07,1.27 43.5,14.92 33.34,9.21 31.75,9.21 28.57,6.99 29.21,1.27 36.83,1.27 60.96,1.27 55.88,1.27 2.54,13.97 2.54,10.16 2.54,23.5 2.54,31.75 52.07,39.37 55.24,25.4 64.14,25.4 64.14,18.41 64.14,33.02 31.43,21.27 24.13,4.45 21.59,13.65
  pour Top (no thermals): 1.91,15.88 8.26,15.88 8.26,18.41 1.91,18.41
  pour Top (no thermals): 19.05,19.68 23.5,19.68 23.5,22.23 19.05,22.23
  pour Top (no thermals): 12.38,8.89 13.65,8.89 13.65,14.29 12.38,14.29 12.38,12.38 10.48,12.38 10.48,11.11 12.38,11.11
  pour Bottom (rank 3): -0.64,41.27 66.67,41.27 66.67,-0.64 -0.64,-0.64
  pour Top (rank 3): -1.27,41.91 67.31,41.91 67.31,-1.27 -1.27,-1.27
I2C_SCL  (via drill 0.3)
  Top 0.305: v33.66,17.14 33.73,17.22 IC1.2 | X1.3 9.53,30.48 | 9.53,30.48 X7.3 | X2.3 19.05,30.48 | 19.05,30.48 X8.3 | X3.3 28.57,30.16 | 28.57,30.16 X9.3 | v11.43,30.48 9.53,30.48 | v20.95,30.48 19.05,30.48 | v30.48,30.48 28.89,30.48 28.57,30.16
  Bottom 0.305: v11.43,30.48 v20.95,30.48 v30.48,30.48 31.11,30.48 32.38,29.21 32.38,18.41 v33.66,17.14
I2C_SDA  (via drill 0.3)
  Top 0.305: IC1.1 34.35,17.72 v33.66,18.41 | X9.1 26.04,31.75 | 26.04,31.75 X3.1 | X2.1 16.51,31.75 | 16.51,31.75 X8.1 | X1.1 6.99,31.75 | 6.99,31.75 X7.1 | v5.71,31.75 6.99,31.75 | v15.24,31.75 16.51,31.75 | v24.77,31.75 26.04,31.75
  Bottom 0.305: v33.66,18.41 33.02,19.05 33.02,29.84 31.11,31.75 v24.77,31.75 v15.24,31.75 v5.71,31.75
LED1  (via drill 0.3)
  Top 0.305: IC1.57 41.02,18.66 41.27,18.41 v45.4,18.41
  Bottom 0.305: v45.4,18.41 46.35,19.37 59.37,19.37 61.52,17.21 RN1.4
LED2  (via drill 0.3)
  Top 0.305: IC1.58 40.52,18.21 40.96,17.78 v44.77,17.78
  Bottom 0.305: v44.77,17.78 45.72,17.78 46.67,18.73 59.05,18.73 60.73,17.06 RN1.3
LED3  (via drill 0.3)
  Top 0.305: IC1.59 40.02,17.8 40.01,17.78 40.64,17.14 v44.13,17.14
  Bottom 0.305: v44.13,17.14 46.04,17.14 46.99,18.1 58.74,18.1 59.92,16.91 RN1.2
LED4  (via drill 0.3)
  Top 0.305: IC1.60 39.52,17.31 40.32,16.51 v43.5,16.51
  Bottom 0.305: v43.5,16.51 46.35,16.51 47.31,17.46 58.42,17.46 59.12,16.76 RN1.1
LEUART-RX  (via drill 0.3)
  Top 0.305: IC1.64 37.52,21.33 v37.78,21.59 | v42.86,26.04 43.81,25.08 X11.2
  Bottom 0.305: v37.78,21.59 37.78,22.86 40.96,26.04 v42.86,26.04
LEUART-TX  (via drill 0.3)
  Top 0.305: IC1.63 38.02,20.74 38.55,21.27 v39.05,21.27 | v45.72,27.94 X11.1
  Bottom 0.305: v39.05,21.27 39.05,23.18 41.27,25.4 43.81,25.4 45.72,27.3 v45.72,27.94
N$1  (via drill 0.3)
  Top 0.305: XUSB.D- 23.33,11.9 v23.5,12.06
  Bottom 0.305: v23.5,12.06 21.82,10.39 IC2.16
N$2  (via drill 0.3)
  Top 0.305: XUSB.D+ 24.13,11.43 v24.77,12.06
  Bottom 0.305: v24.77,12.06 22.45,9.74 IC2.15
N$3
  Top 0.305: L1.1 R1.2
N$4  (via drill 0.3)
  Top 0.406: TX.C 28.89,15.88 v29.21,16.19
  Bottom 0.406: v29.21,16.19 30.48,17.46 30.48,21.59 29.53,22.54 R8.2
N$5
  Bottom 0.305: IC2.19 17.5,12.35 16.19,13.65 R6.1 R7.2
N$6
  Top 0.305: C6.1 49.53,13.97 49.28,13.72 IC1.40
N$7  (via drill 0.3)
  Top 0.406: RX.C 26.35,16.19 27.62,17.46 v29.21,17.46
  Bottom 0.406: v29.21,17.46 29.21,20 R9.2
N$8
  Top 0.305: IC1.15 33.9,10.72 32.62,9.45 C7.1 32.62,5 Q1.1
N$9
  Bottom 0.305: IC2.23 21.61,14.95 24.13,17.46 24.13,20.64 26.04,22.54 R8.1
N$10
  Bottom 0.305: IC2.22 21.91,14.29 24.77,17.14 24.77,19.05 26.04,20.32 R9.1
N$11
  Top 0.305: SJ2.1 7.3,11.02 R4A.1
N$12
  Top 0.305: IC1.27 42.52,9.86 41.91,10.48 40.96,10.48 40.52,10.04 IC1.23 40.52,6.31 C5.1 40.01,5.71 40.64,5.08 40.64,3.5 R1.1
N$13
  Top 0.305: IC1.16 34.35,10.22 33.97,9.84 33.97,5.79 C8.1 33.97,5.64 33.97,3.49 32.7,2.22 32.38,2.22 | Q1.2 32.38,2.22 | 32.62,1.98 32.38,2.22
N$14
  Bottom 0.61: IC4.1 40.33,7.93 43.81,4.45 43.81,3.49 46.04,1.27 49.53,1.27 50.16,1.91 50.16,2.54 48.98,3.72 SD1.4
N$15  (via drill 0.3)
  Top 0.406: TX.A RX.A 25.18,12.92 v24.77,13.34
  Bottom 0.305: C13.1 18.39,11.04 IC2.17 19.93,11.04 | IC2.4 25.14,16.25
  Bottom 0.406: 19.93,11.04 23.5,14.61 | 23.5,14.61 25.14,16.25 | v24.77,13.34 23.5,14.61
N$16
  Top 0.305: SJ2.3 7.3,8.98 R4B.1
N$17
  Top 0.254: 12.38,19.05 12.38,18.78 IC3.13
  Top 0.61: 12.38,19.05 12.38,20.32 13.02,20.95
  pour Top (rank 2, no thermals): 12.06,21.59 12.7,22.23 17.78,22.23 18.41,21.59 18.41,20.32 12.06,20.32
N$18
  Top 0.305: IC3.7 10.04,15.44 9.21,14.61 5.71,14.61 5.4,14.29 R2.2 | R2.2 | R2.2 R4A.2 | R4A.2 5.4,10.8 R4B.2 | R4A.2
N$23  (via drill 0.3)
  Top 0.305: D0.A 64.77,11.43 v64.14,10.79
  Bottom 0.305: RN1.5 61.52,12.13 62.87,10.79 v64.14,10.79
N$24  (via drill 0.3)
  Top 0.305: D1.A 62.23,11.43 v61.59,10.79
  Bottom 0.305: RN1.6 60.73,11.66 v61.59,10.79
N$25  (via drill 0.3)
  Top 0.305: D2.A 59.69,11.43 v59.05,10.79
  Bottom 0.305: RN1.7 59.92,11.66 v59.05,10.79
N$26  (via drill 0.3)
  Top 0.305: D3.A 57.15,11.43 v56.52,10.79
  Bottom 0.305: RN1.8 59.12,12.13 57.78,10.79 v56.52,10.79
N$140
  Top 0.305: R10.1 R11.2 14.1,5.84 SJ1.1
PGOOD_SET
  Top 0.305: IC3.8 11.54,15.36 11.11,14.92 R3.2 R2.1
S1
  Top 0.305: IC1.47 53.58,17.22 54.05,16.75 S1.3 S1.4
S2
  Top 0.305: IC1.48 53.6,17.72 55.88,20 55.88,23.18 | 55.88,23.18 54.05,23.18 S2.3 | 55.88,23.18 64.06,23.18 S2.4
SD_CLK  (via drill 0.3)
  Top 0.305: v48.9,14.61 48.78,14.72 IC1.42
  Bottom 0.305: SD1.5 50.09,9.92 48.9,11.11 v48.9,14.61
SD_CS  (via drill 0.3)
  Top 0.305: IC1.41 44.52,14.22 v44.45,14.29
  Bottom 0.305: SD1.2 46.78,9.41 45.72,10.48 45.72,13.02 v44.45,14.29
SD_MISO  (via drill 0.3)
  Top 0.305: v50.16,15.56 49.83,15.22 IC1.43
  Bottom 0.305: SD1.7 52.28,5.5 51.12,6.67 51.12,10.16 50.16,11.11 v50.16,15.56
SD_MOSI  (via drill 0.3)
  Top 0.305: v45.09,15.56 45.25,15.72 IC1.44
  Bottom 0.305: v45.09,15.56 45.09,14.61 46.35,13.34 46.35,10.79 47.88,9.27 SD1.3
SD_PWR  (via drill 0.3)
  Top 0.305: IC1.46 44.98,16.72 44.13,15.88 40.64,15.88 40.01,15.24 40.01,12.06 39.05,11.11 38.1,11.11 36.2,9.21 v34.92,9.21
  Bottom 0.305: v34.92,9.21 35.24,9.21 35.88,8.57 35.88,8.05 IC4.6
SPI_CLK
  Top 0.305: X4.3 38.73,36.2 | 38.73,36.2 X10.3 38.73,23.5 36.83,21.59 36.83,18.89 39.37,16.35 39.37,12.38 38.71,11.72 IC1.13 | X5.3 46.04,36.2 45.72,36.2 44.77,35.24 43.5,35.24 42.55,36.2 38.73,36.2
SPI_CS1  (via drill 0.3)
  Top 0.305: IC1.14 32.91,11.22 31.11,13.02 31.11,15.56 v31.43,15.88 | v39.99,27.31 40.01,27.31 X4.4
  Bottom 0.305: v31.43,15.88 32.07,16.51 33.97,16.51 34.61,17.14 34.61,22.24 39.67,27.31 v39.99,27.31
SPI_CS2  (via drill 0.3)
  Top 0.305: X10.4 40.01,23.81 40.32,23.5 v41.91,23.5 | IC1.37 43.98,12.22 v43.18,13.02
  Bottom 0.305: v41.91,23.5 41.91,22.86 41.59,22.54 41.59,14.61 v43.18,13.02
SPI_CS3  (via drill 0.3)
  Top 0.305: IC1.38 44.75,12.72 v44.45,13.02 | v49.53,27.3 X5.4
  Bottom 0.305: v44.45,13.02 42.86,14.61 42.86,21.59 48.58,27.3 v49.53,27.3
SPI_MISO  (via drill 0.3)
  Top 0.305: IC1.12 38.26,12.22 38.73,12.7 38.73,16.03 36.2,18.57 36.2,21.91 37.47,23.18 X10.2 v37.47,36.2 X4.2 | X5.2 v42.86,33.97
  Bottom 0.305: v42.86,33.97 39.69,33.97 v37.47,36.2
SPI_MOSI  (via drill 0.3)
  Top 0.305: X4.1 v36.2,36.2 X10.1 36.16,29.82 36.16,22.83 v35.24,21.91 | IC1.11 37.8,12.72 38.1,13.02 38.1,15.56 v36.83,16.83 | v42.87,38.74 X5.1
  Bottom 0.305: v42.87,38.74 38.1,38.74 36.2,36.83 v36.2,36.2 | v35.24,21.91 35.24,17.14 35.56,16.83 v36.83,16.83
UART-RX  (via drill 0.3)
  Top 0.305: IC1.10 37.35,13.22 v37.47,13.34
  Bottom 0.305: 26.89,18.2 IC2.1 27.21,18.2 27.94,17.46 27.94,15.88 28.89,14.92 36.83,14.92 37.15,15.24 37.78,15.24 38.1,14.92 38.1,13.97 v37.47,13.34
UART-TX  (via drill 0.3)
  Top 0.305: IC1.9 36.58,13.72 v37.47,14.61
  Bottom 0.305: IC2.5 27.27,15.6 28.57,14.29 37.15,14.29 v37.47,14.61
VEH
  Top 0.61: JP2.4 5.71,0.64 10.79,0.64 MOD1.VEH
VIN
  Top 0.305: IC3.6 9.11,16.09 8.26,15.24 1.27,15.24
  Top 0.61: JP2.1 1.27,7.62 1.27,15.24 1.27,19.68 1.58,20
  pour Top (no thermals): 1.27,21.27 2.22,22.23 9.53,22.23 10.48,21.27 10.48,19.37 9.53,19.37 9.21,19.68 1.27,19.68
VIN_OK  (via drill 0.3)
  Top 0.305: IC3.10 13.52,17.28 14.92,15.88 14.92,8.26 v14.61,7.94 | IC1.17 37.52,7.36 37.15,6.99 35.88,6.99 v34.92,7.94
  Bottom 0.305: v14.61,7.94 17.78,7.94 18.41,8.57 33.66,8.57 34.29,7.94 v34.92,7.94
VOUT_SET
  Top 0.305: IC3.9 13.06,16.78 13.34,16.51 13.34,15.56 14.29,14.61 14.29,8.89 13.65,8.26 12.06,8.26 11.43,8.89 11.43,9.53 11.12,9.53 R5.2 SJ2.2
VUSB  (via drill 0.3)
  Top 0.305: v20.64,13.02 22.53,11.12 XUSB.VBUS
  Top 0.61: v19.68,6.99 20,6.99 22.53,9.51 XUSB.VBUS
  Bottom 0.305: R6.2 16.19,15.24 17.14,15.24 17.78,14.61 17.78,13.34 18.12,12.99 IC2.20 20.61,12.99 v20.64,13.02
  Bottom 0.61: JP2.3 8.26,6.99 v19.68,6.99

### Text on the board
tPlace: 1 | 4 | USB | VEH | 5V | 5 | 8 | 5V/2 / ADC0
tNames: Datalogger | vers. 1.0
tStop: by Jan Kokert / 29.01.2016
bStop: 1 | 1